# EAGLE design cryptostick-0v3 (EAGLE 6.6.0)

## Sheet 1 of 3: FTDI USB-Conn., FTDI-Chip
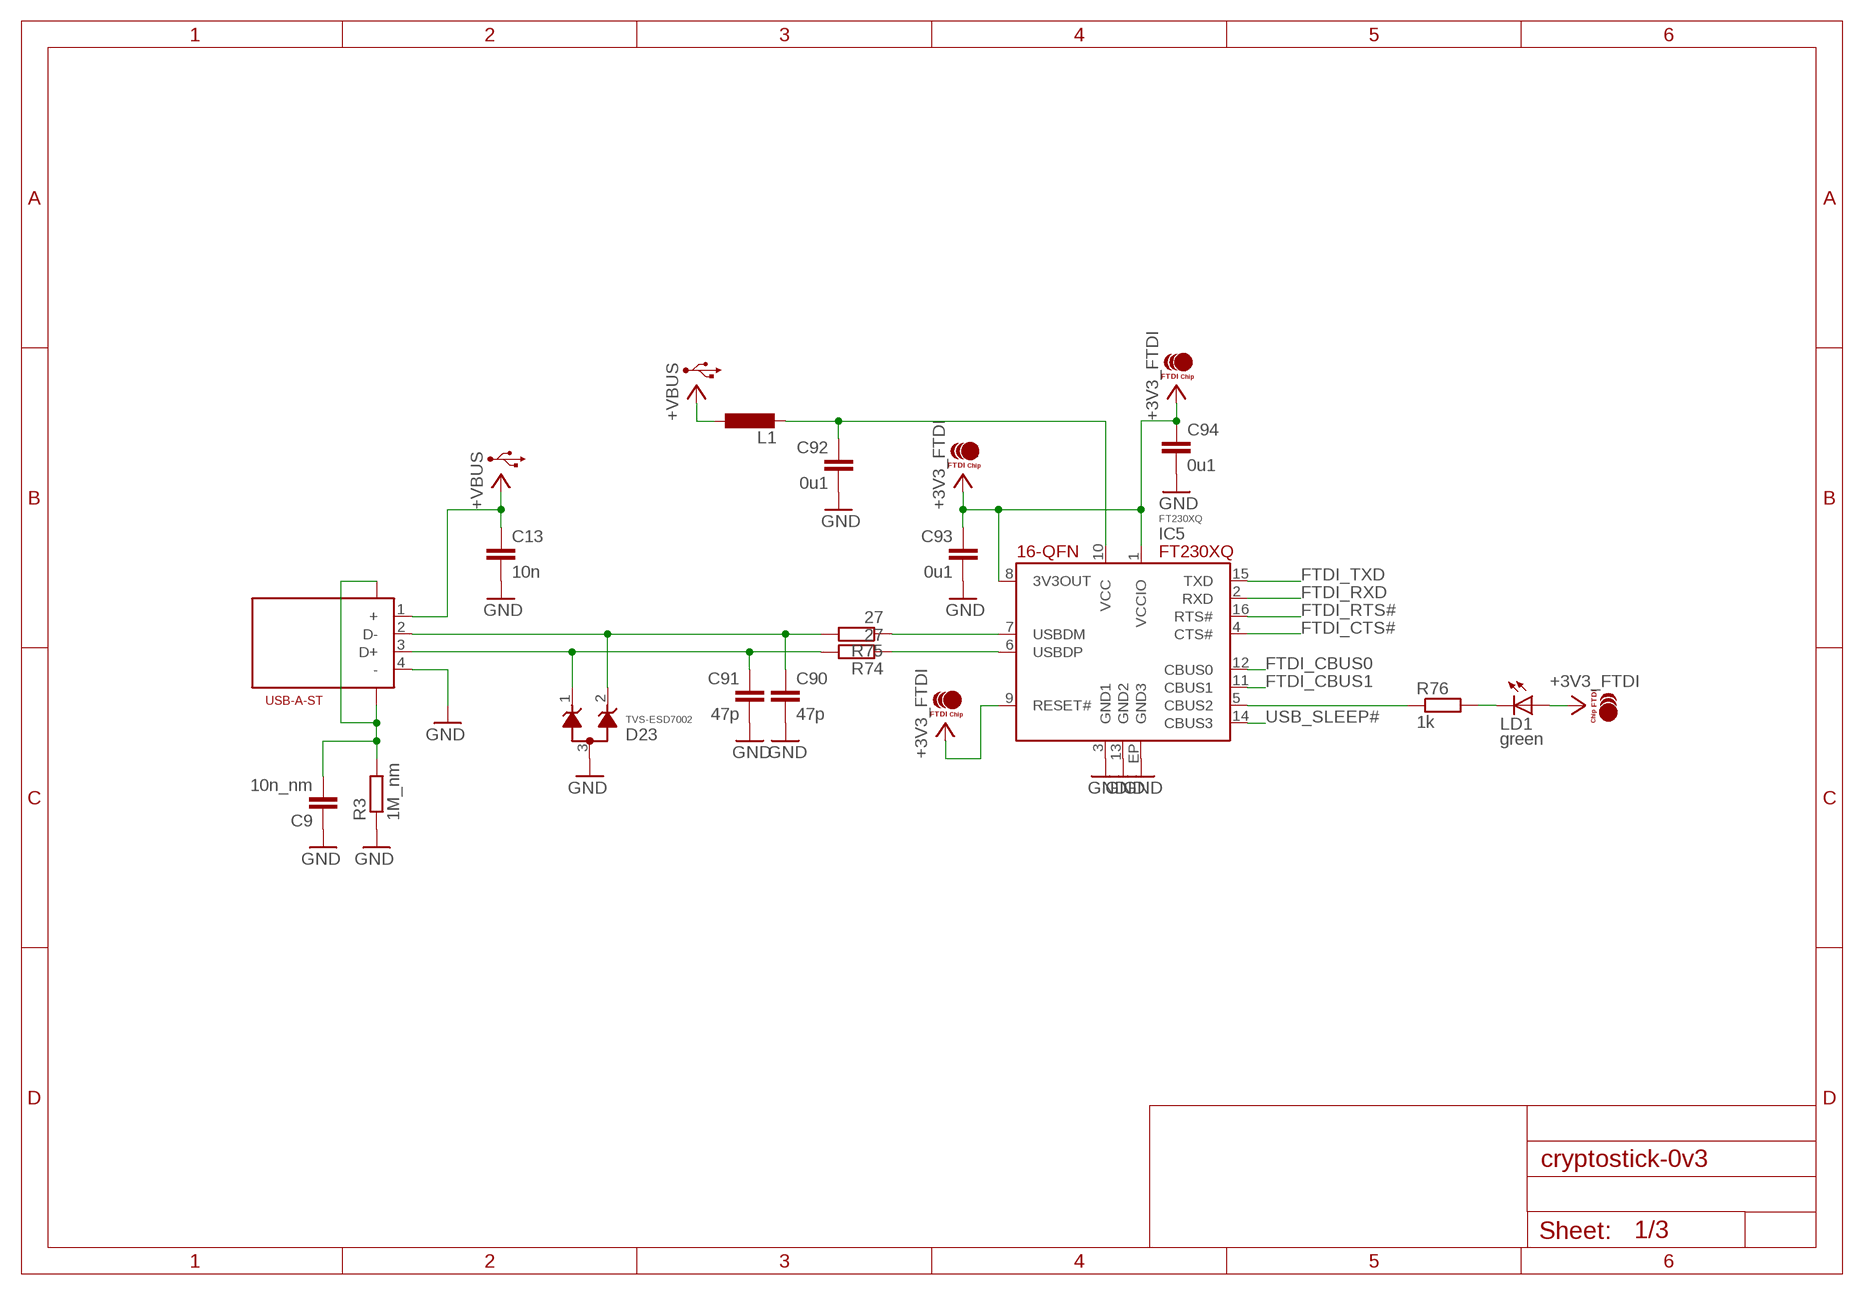
[diagram p0: schematic, sheet 1]

### Parts
C9  10n_nm  C-EUC0603  [C0603]
C13  10n  C-EUR0402-MCU  [R0402-MCU]
C90  47p  C-EUR0402-MCU  [R0402-MCU]
C91  47p  C-EUR0402-MCU  [R0402-MCU]
C92  0u1  C-EUR0402-MCU  [R0402-MCU]
C93  0u1  C-EUR0402-MCU  [R0402-MCU]
C94  0u1  C-EUR0402-MCU  [R0402-MCU]
D23  TVS-ESD7002  [SC70-3]
IC5  FT230XQ  [16QFN-FT230X]
J1  USB-A-ST  [USB-A-ST]
L1  L-EUR0402-MCU  [R0402-MCU]
LD1  green  LED-0603-SIDELED-RPI  [0603-SIDELED-RPI]
R3  1M_nm  R-EU_R0603  [R0603]
R74  27  R-EU_R0402-MCU  [R0402-MCU]
R75  27  R-EU_R0402-MCU  [R0402-MCU]
R76  1k  R-EU_R0402-MCU  [R0402-MCU]

### Nets
+3V3_FTDI: C93.1 C94.1 IC5.1(VCCIO) IC5.8(3V3OUT) IC5.9(RESET#) LD1.A ; also sheet 2,3
+5V_FTDI: C92.1 IC5.10(VCC) L1.2
+VBUS: C13.1 J1.1(+) L1.1 ; also sheet 2,3
FTDI_CBUS0: IC5.12(CBUS0) ; also sheet 2
FTDI_CBUS1: IC5.11(CBUS1) ; also sheet 2
FTDI_CTS#: IC5.4(CTS#) ; also sheet 2
FTDI_RTS#: IC5.16(RTS#) ; also sheet 2
FTDI_RXD: IC5.2(RXD) ; also sheet 2
FTDI_TXD: IC5.15(TXD) ; also sheet 2
FTDI_TXLED#: IC5.5(CBUS2) R76.1
GND: C9.1 C13.2 C90.2 C91.2 C92.2 C93.2 C94.2 D23.3 IC5.3(GND1) IC5.13(GND2) IC5.EP(GND3) J1.4(-) R3.1 ; also sheet 2,3
N$10: LD1.C R76.2
N$39: IC5.7(USBDM) R75.1
N$40: IC5.6(USBDP) R74.1
N$75: C91.1 D23.1 J1.3(D+) R74.2
N$76: C90.1 D23.2 J1.2(D-) R75.2
USB_SHLD: C9.2 J1.SH1 J1.SH2 R3.2
USB_SLEEP#: IC5.14(CBUS3) ; also sheet 2

## Sheet 2 of 3: MCU MSP430 Microcontroller, Crypto-IC
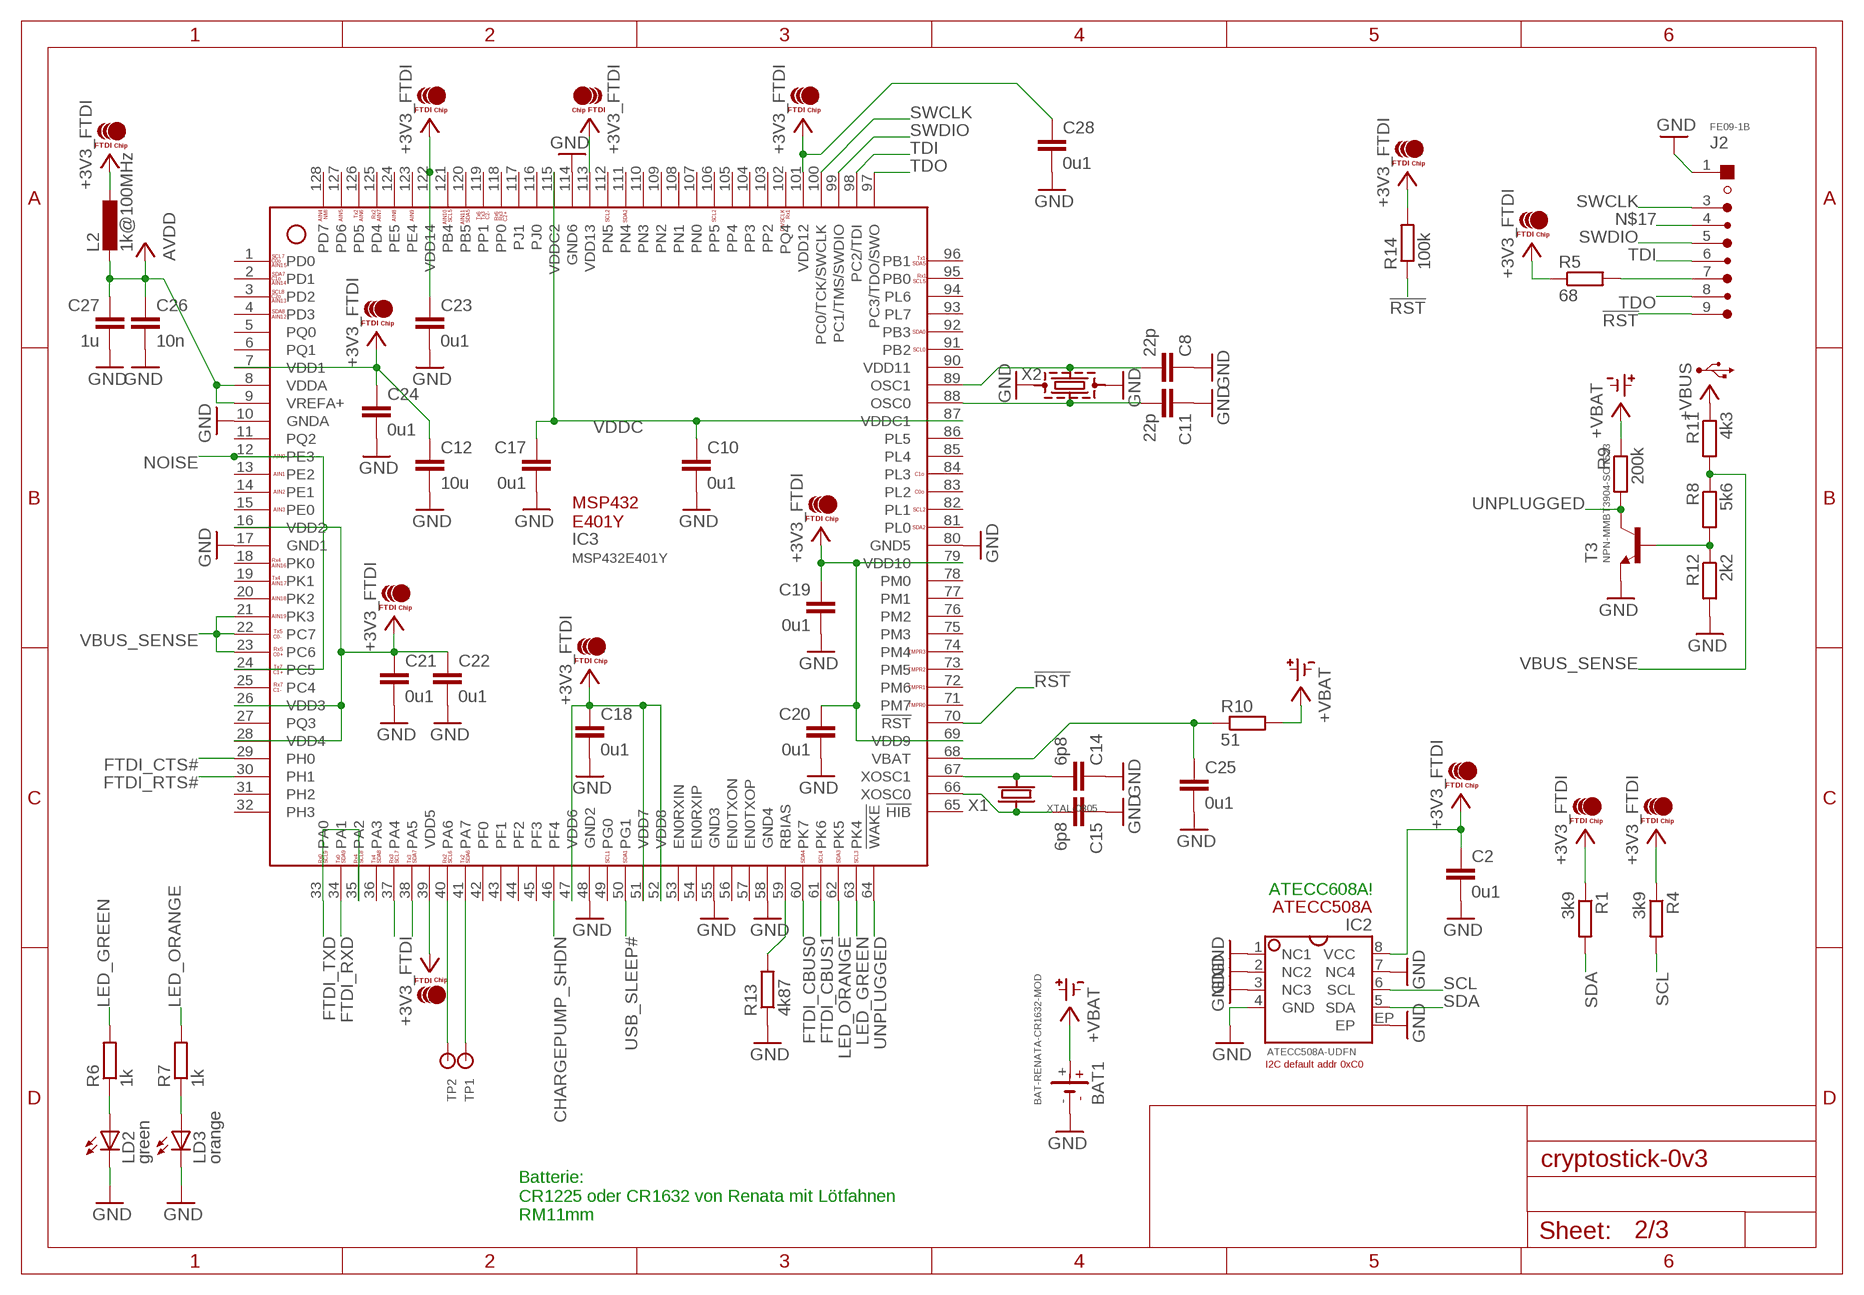
[diagram p1: schematic, sheet 2]

### Parts
BAT1  BAT-RENATA-CR1632-MOD  [BAT-RENATA-CR1632-MOD]
C2  0u1  C-EUR0402-MCU  [R0402-MCU]
C8  22p  C-EUR0402-MCU  [R0402-MCU]
C10  0u1  C-EUR0402-MCU  [R0402-MCU]
C11  22p  C-EUR0402-MCU  [R0402-MCU]
C12  10u  C-EUR0603-MCU  [R0603-MCU]
C14  6p8  C-EUR0402-MCU  [R0402-MCU]
C15  6p8  C-EUR0402-MCU  [R0402-MCU]
C17  0u1  C-EUR0402-MCU  [R0402-MCU]
C18  0u1  C-EUR0402-MCU  [R0402-MCU]
C19  0u1  C-EUR0402-MCU  [R0402-MCU]
C20  0u1  C-EUR0402-MCU  [R0402-MCU]
C21  0u1  C-EUR0402-MCU  [R0402-MCU]
C22  0u1  C-EUR0402-MCU  [R0402-MCU]
C23  0u1  C-EUR0402-MCU  [R0402-MCU]
C24  0u1  C-EUR0402-MCU  [R0402-MCU]
C25  0u1  C-EUR0402-MCU  [R0402-MCU]
C26  10n  C-EUR0402-MCU  [R0402-MCU]
C27  1u  C-EUR0402-MCU  [R0402-MCU]
C28  0u1  C-EUR0402-MCU  [R0402-MCU]
IC2  ATECC508A-UDFN  [8UDFN]
IC3  MSP432E401Y  [128TQFP-MSP432E401Y]
J2  FE09-1B  [FE09-1B]
L2  1k@100MHz  L-EUR0402-MCU  [R0402-MCU]
LD2  green  LED-0603-SIDELED-RPI  [0603-SIDELED-RPI]
LD3  orange  LED-0603-SIDELED-RPI  [0603-SIDELED-RPI]
R1  3k9  R-EU_R0402-MCU  [R0402-MCU]
R4  3k9  R-EU_R0402-MCU  [R0402-MCU]
R5  68  R-EU_R0402-MCU  [R0402-MCU]
R6  1k  R-EU_R0402-MCU  [R0402-MCU]
R7  1k  R-EU_R0402-MCU  [R0402-MCU]
R8  5k6  R-EU_R0402-MCU  [R0402-MCU]
R9  200k  R-EU_R0402-MCU  [R0402-MCU]
R10  51  R-EU_R0402-MCU  [R0402-MCU]
R11  4k3  R-EU_R0402-MCU  [R0402-MCU]
R12  2k2  R-EU_R0402-MCU  [R0402-MCU]
R13  4k87  R-EU_R0402-MCU  [R0402-MCU]
R14  100k  R-EU_R0402-MCU  [R0402-MCU]
T3  NPN-MMBT3904-SOT523  [SOT523]
TP1  TP-SMT-1.5MM  [TP-SMT-1.5MM]
TP2  TP-SMT-1.5MM  [TP-SMT-1.5MM]
X1  XTAL-0805  [XTAL-32KHZ-0805]
X2  XTAL-2.0X1.6-MOD  [XTAL-2.0X1.6-MOD]

### Nets
!RST: IC3.70(!RST) J2.9 R14.1
+3V3_FTDI: C2.1 C12.1 C18.1 C19.1 C20.1 C21.1 C22.1 C23.1 C24.1 C28.1 IC2.8(VCC) IC3.7(VDD1) IC3.16(VDD2) IC3.26(VDD3) IC3.28(VDD4) IC3.39(VDD5) IC3.47(VDD6) IC3.51(VDD7) IC3.52(VDD8) IC3.69(VDD9) IC3.79(VDD10) IC3.101(VDD12) IC3.113(VDD13) IC3.122(VDD14) L2.1 R1.1 R4.1 R5.1 R14.2 ; also sheet 1,3
+VBAT: BAT1.+ R9.1 R10.2
+VBUS: R11.1 ; also sheet 1,3
AVDD: C26.1 C27.1 IC3.8(VDDA) IC3.9(VREFA+) L2.2
CHARGEPUMP_SHDN: IC3.46(PF4) ; also sheet 3
DBG_RXD: IC3.40(PA6) IC3.74(PM4) TP2.1
DBG_TXD: IC3.41(PA7) IC3.73(PM5) TP1.1
FTDI_CBUS0: IC3.60(PK7) ; also sheet 1
FTDI_CBUS1: IC3.61(PK6) ; also sheet 1
FTDI_CTS#: IC3.29(PH0) ; also sheet 1
FTDI_RTS#: IC3.30(PH1) ; also sheet 1
FTDI_RXD: IC3.34(PA1) ; also sheet 1
FTDI_TXD: IC3.33(PA0) IC3.35(PA2) ; also sheet 1
GND: BAT1.- C2.2 C8.1 C10.2 C11.1 C12.2 C14.1 C15.1 C17.2 C18.2 C19.2 C20.2 C21.2 C22.2 C23.2 C24.2 C25.2 C26.2 C27.2 C28.2 IC2.1(NC1) IC2.2(NC2) IC2.3(NC3) IC2.4(GND) IC2.7(NC4) IC2.EP IC3.10(GNDA) IC3.17(GND1) IC3.48(GND2) IC3.55(GND3) IC3.58(GND4) IC3.80(GND5) IC3.114(GND6) J2.1 LD2.C LD3.C R12.2 R13.1 T3.2(E) X2.2(GND1) X2.4(GND2) ; also sheet 1,3
LED_GREEN: IC3.63(PK4) R6.2
LED_ORANGE: IC3.62(PK5) R7.2
N$1: J2.7 R5.2
N$3: LD3.A R7.1
N$4: LD2.A R6.1
N$11: C11.2 IC3.88(OSC0) X2.1
N$13: C8.2 IC3.89(OSC1) X2.3
N$14: C25.1 IC3.68(VBAT) R10.1
N$16: C14.2 IC3.67(XOSC1) X1.P$1
N$17: J2.4
N$18: R8.2 R12.1 T3.1(B)
N$19: C15.2 IC3.66(XOSC0) X1.P$2
N$21: IC3.59(RBIAS) R13.2
NOISE: IC3.12(PE3) IC3.24(PC5) ; also sheet 3
SCL: IC2.6(SCL) IC3.37(PA4) R4.2
SDA: IC2.5(SDA) IC3.38(PA5) R1.2
SWCLK: IC3.100(PC0/TCK/SWCLK) J2.3
SWDIO: IC3.99(PC1/TMS/SWDIO) J2.5
TDI: IC3.98(PC2/TDI) J2.6
TDO: IC3.97(PC3/TDO/SWO) J2.8
UNPLUGGED: IC3.64(!WAKE) IC3.72(PM6) R9.2 T3.3(C)
USB_SLEEP#: IC3.50(PG1) ; also sheet 1
VBUS_SENSE: IC3.21(PK3) IC3.22(PC7) IC3.23(PC6) R8.1 R11.2
VDDC: C10.1 C17.1 IC3.87(VDDC1) IC3.115(VDDC2)
Unconnected: IC3.1(PD0) IC3.2(PD1) IC3.3(PD2) IC3.4(PD3) IC3.5(PQ0) IC3.6(PQ1) IC3.11(PQ2) IC3.13(PE2) IC3.14(PE1) IC3.15(PE0) IC3.18(PK0) IC3.19(PK1) IC3.20(PK2) IC3.25(PC4) IC3.27(PQ3) IC3.31(PH2) IC3.32(PH3) IC3.36(PA3) IC3.42(PF0) IC3.43(PF1) IC3.44(PF2) IC3.45(PF3) IC3.49(PG0) IC3.53(EN0RXIN) IC3.54(EN0RXIP) IC3.56(EN0TXON) IC3.57(EN0TXOP) IC3.65(!HIB) IC3.71(PM7) IC3.75(PM3) IC3.76(PM2) IC3.77(PM1) IC3.78(PM0) IC3.81(PL0) IC3.82(PL1) IC3.83(PL2) IC3.84(PL3) IC3.85(PL4) IC3.86(PL5) IC3.90(VDD11) IC3.91(PB2) IC3.92(PB3) IC3.93(PL7) IC3.94(PL6) IC3.95(PB0) IC3.96(PB1) IC3.102(PQ4) IC3.103(PP2) IC3.104(PP3) IC3.105(PP4) IC3.106(PP5) IC3.107(PN0) IC3.108(PN1) IC3.109(PN2) IC3.110(PN3) IC3.111(PN4) IC3.112(PN5) IC3.116(PJ0) IC3.117(PJ1) IC3.118(PP0) IC3.119(PP1) IC3.120(PB5) IC3.121(PB4) IC3.123(PE4) IC3.124(PE5) IC3.125(PD4) IC3.126(PD5) IC3.127(PD6) IC3.128(PD7)

### Notes on the sheet
- ATECC608A!
- Batterie:
  CR1225 oder CR1632 von Renata mit Lötfahnen
  RM11mm

## Sheet 3 of 3: TRNG True Random Noise Generator: Noise Diode, Charge Pump
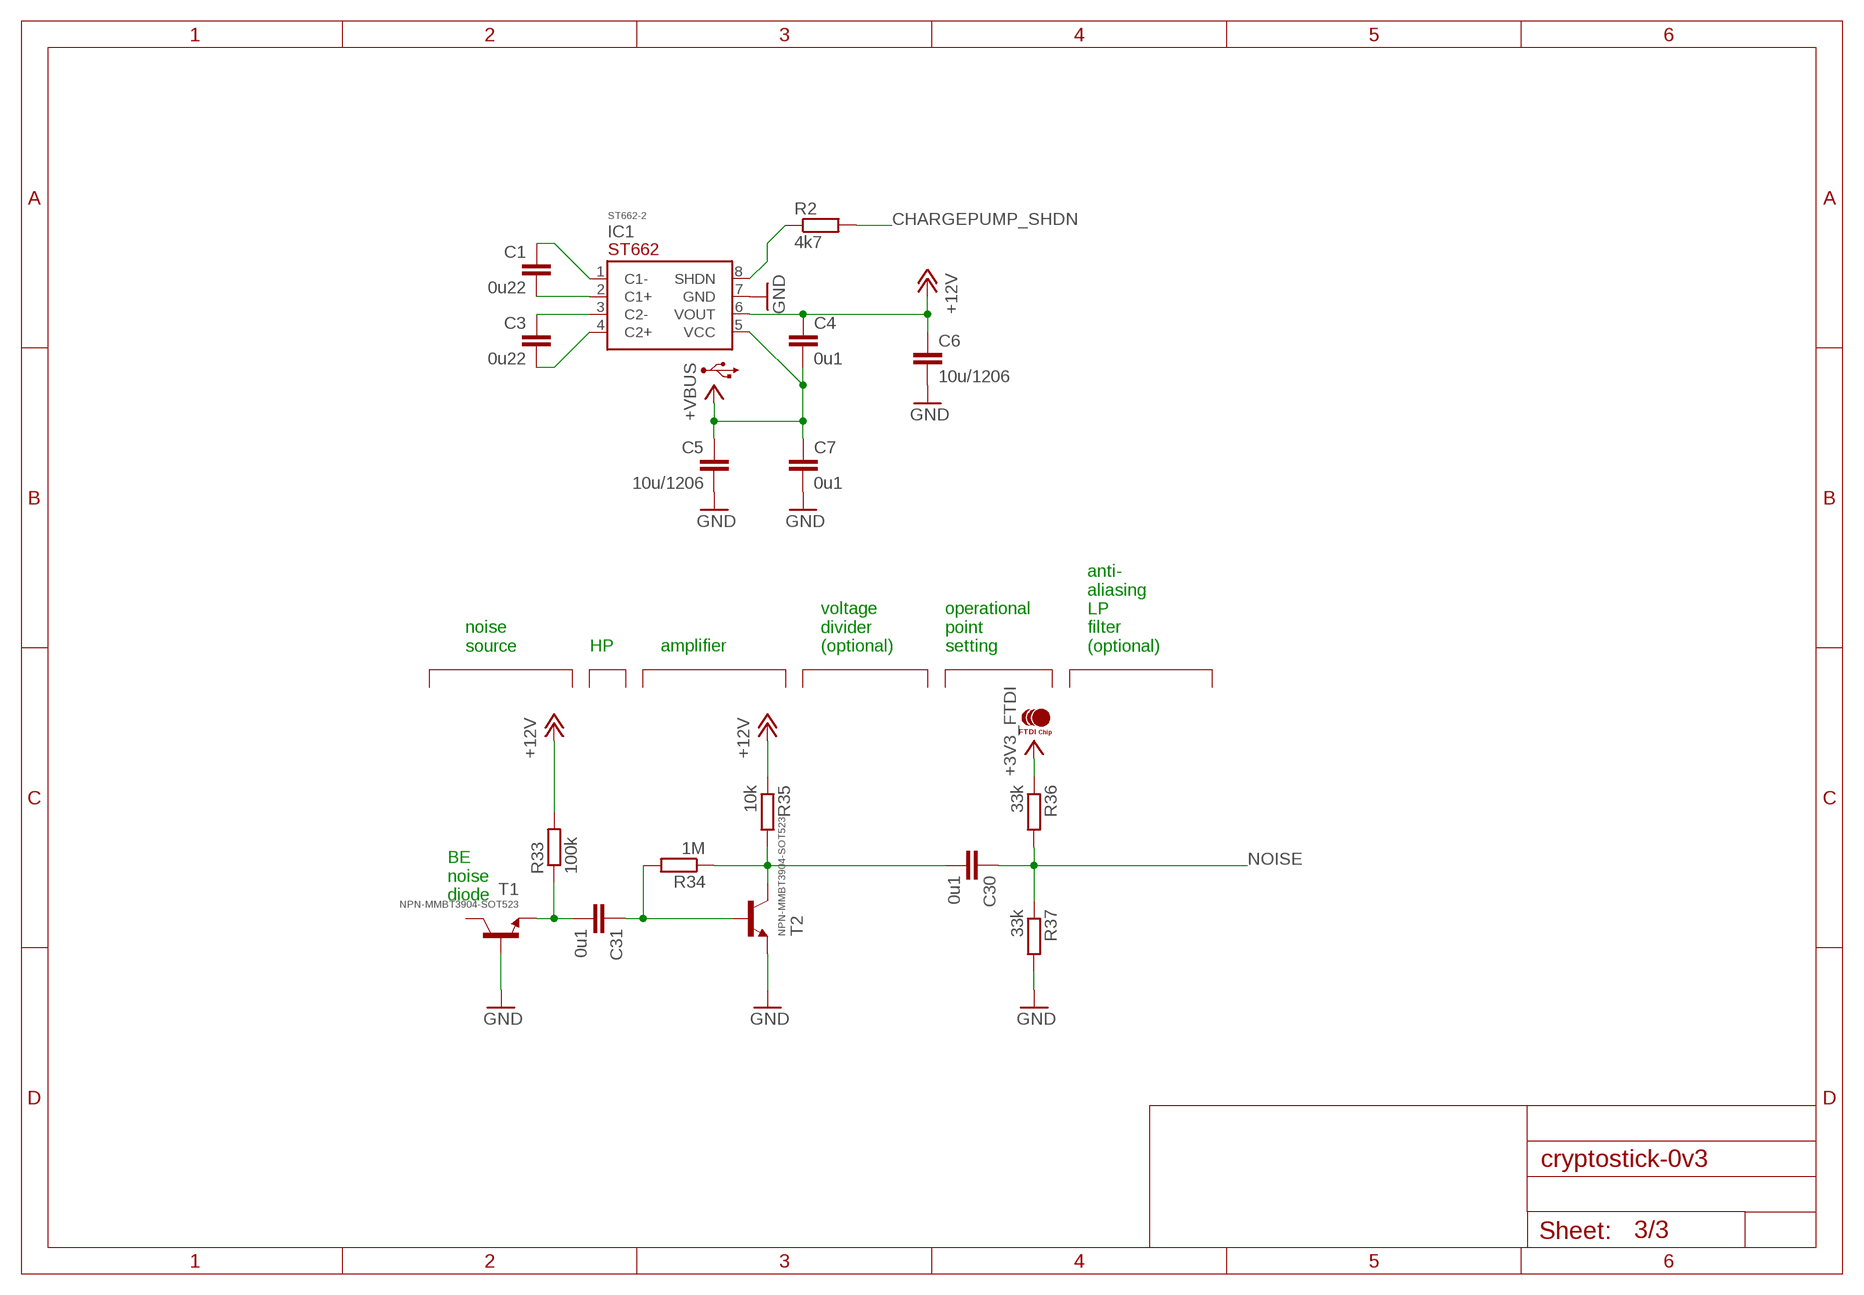
[diagram p2: schematic, sheet 3]

### Parts
C1  0u22  C-EUC0603  [C0603]
C3  0u22  C-EUC0603  [C0603]
C4  0u1  C-EUR0402-MCU  [R0402-MCU]
C5  10u/1206  C-EUC1206  [C1206]
C6  10u/1206  C-EUC1206  [C1206]
C7  0u1  C-EUR0402-MCU  [R0402-MCU]
C30  0u1  C-EUR0402-MCU  [R0402-MCU]
C31  0u1  C-EUR0402-MCU  [R0402-MCU]
IC1  ST662-2  [8SOIC-2]
R2  4k7  R-EU_R0402-MCU  [R0402-MCU]
R33  100k  R-EU_R0402-MCU  [R0402-MCU]
R34  1M  R-EU_R0402-MCU  [R0402-MCU]
R35  10k  R-EU_R0402-MCU  [R0402-MCU]
R36  33k  R-EU_R0402-MCU  [R0402-MCU]
R37  33k  R-EU_R0402-MCU  [R0402-MCU]
T1  NPN-MMBT3904-SOT523  [SOT523]
T2  NPN-MMBT3904-SOT523  [SOT523]

### Nets
+3V3_FTDI: R36.1 ; also sheet 1,2
+12V: C4.1 C6.1 IC1.6(VOUT) R33.2 R35.1
+VBUS: C4.2 C5.1 C7.1 IC1.5(VCC) ; also sheet 1,2
CHARGEPUMP_SHDN: R2.2 ; also sheet 2
GND: C5.2 C6.2 C7.2 IC1.7(GND) R37.2 T1.1(B) T2.2(E) ; also sheet 1,2
N$2: C31.1 R34.2 T2.1(B)
N$5: C30.2 R34.1 R35.2 T2.3(C)
N$6: C3.1 IC1.3(C2-)
N$7: C1.2 IC1.2(C1+)
N$8: C1.1 IC1.1(C1-)
N$9: C3.2 IC1.4(C2+)
N$12: IC1.8(SHDN) R2.1
N$35: C31.2 R33.1 T1.2(E)
NOISE: C30.1 R36.2 R37.1 ; also sheet 2
Unconnected: T1.3(C)

### Notes on the sheet
- noise
  source
- HP | amplifier
- voltage
  divider
  (optional)
- operational
  point
  setting
- anti-
  aliasing
  LP
  filter
  (optional)
- BE
  noise
  diode

## Library data of the parts
BAT1 = cryptostick:BAT
C1-C15 C17-C28 C30 C31 C90-C94 = rcl:C-EU: CAPACITOR, European symbol
D23 = hg-box:TVS-ESD7002
IC1 = cryptostick:ST662
IC2 = hg-box:ATECC508A-UDFN
IC3 = cryptostick:MSP432E401Y
IC5 = bdsm:FT230XQ
J1 = cocs:USB-A-ST
J2 = cryptostick:FE09-1B
L1 L2 = rcl:L-EU: INDUCTOR, European symbol
LD1-LD3 = led:LED: LED OSRAM: - CHIPLED LG R971, LG N971, LY N971, LG Q971, LY Q971, LO R971, LY R971 LH N974, LH R974 LS Q976, LO Q976, LY Q976 LO Q996 - Hyper CHIPLED LW Q18S LB Q993, LB Q99A, LB R99A - SideLED LS A670, LO A670, LY A670, LG A670, LP A670 LB A673, LV A673, LT A673, LW A673 LH A674 LY A675 LS A676, LA A676, LO A676, LY A676, LW A676 LS A679, LY A679, LG A679 - Hyper Micro SIDELED® LS Y876, LA Y876, LO Y876, LY Y876 LT Y87S - SmartLED LW L88C, LW L88S LB L89C, LB L89S, LG L890 LS L89K, LO L89K, LY L89K LS L896, LA L896, LO L896, LY L896 - TOPLED LS T670, LO T670, LY T670, LG T670, LP T670 LSG T670, LSP T670, LSY T670, LOP T670, LYG T670 LG T671, LOG T671, LSG T671 LB T673, LV T673, LT T673, LW T673 LH T674 LS T676, LA T676, LO T676, LY T676, LB T676, LH T676, LSB T676, LW T676 LB T67C, LV T67C, LT T67C, LS T67K, LO T67K, LY T67K, LW E67C LS E67B, LA E67B, LO E67B, LY E67B, LB E67C, LV E67C, LT E67C LW T67C LS T679, LY T679, LG T679 LS T770, LO T770, LY T770, LG T770, LP T770 LB T773, LV T773, LT T773, LW T773 LH T774 LS E675, LA E675, LY E675, LS T675 LS T776, LA T776, LO T776, LY T776, LB T776 LHGB T686 LT T68C, LB T68C - Hyper Mini TOPLED® LB M676 - Mini TOPLED Santana® LG M470 LS M47K, LO M47K, LY M47K Source: http://www.osram.convergy.de LUXEON: - LUMILED® LXK2-PW12-R00, LXK2-PW12-S00, LXK2-PW14-U00, LXK2-PW14-V00 LXK2-PM12-R00, LXK2-PM12-S00, LXK2-PM14-U00 LXK2-PE12-Q00, LXK2-PE12-R00, LXK2-PE12-S00, LXK2-PE14-T00, LXK2-PE14-U00 LXK2-PB12-K00, LXK2-PB12-L00, LXK2-PB12-M00, LXK2-PB14-N00, LXK2-PB14-P00, LXK2-PB14-Q00 LXK2-PR12-L00, LXK2-PR12-M00, LXK2-PR14-Q00, LXK2-PR14-R00 LXK2-PD12-Q00, LXK2-PD12-R00, LXK2-PD12-S00 LXK2-PH12-R00, LXK2-PH12-S00 LXK2-PL12-P00, LXK2-PL12-Q00, LXK2-PL12-R00 Source: www.luxeon.com KINGBRIGHT: KA-3528ASYC Source: www.kingbright.com
R1-R14 R33-R37 R74-R76 = rcl:R-EU_: RESISTOR, European symbol
T1-T3 = bdsm:NPN-MMBT3904
TP1 TP2 = hg-box:TP
X1 = cocs:XTAL-0805
X2 = cocs:XTAL

## Board
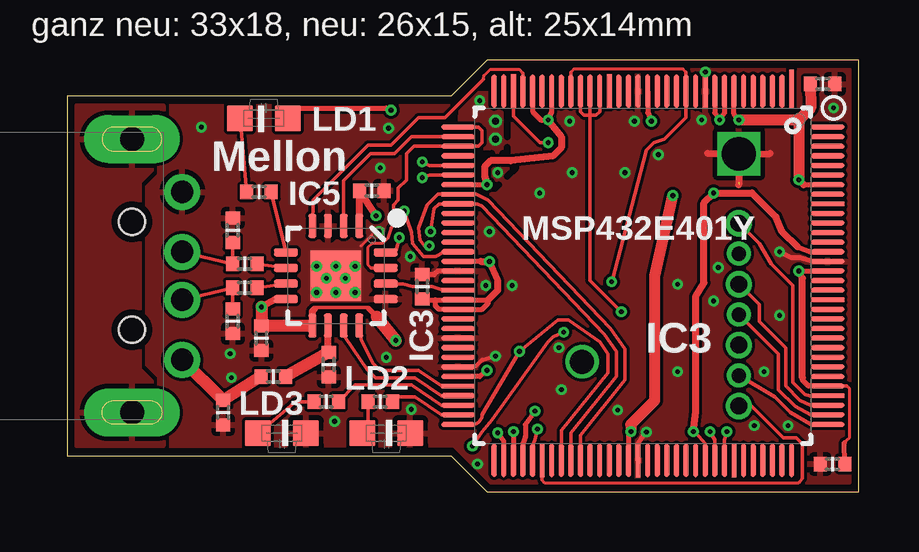
[diagram p3: board, top side]
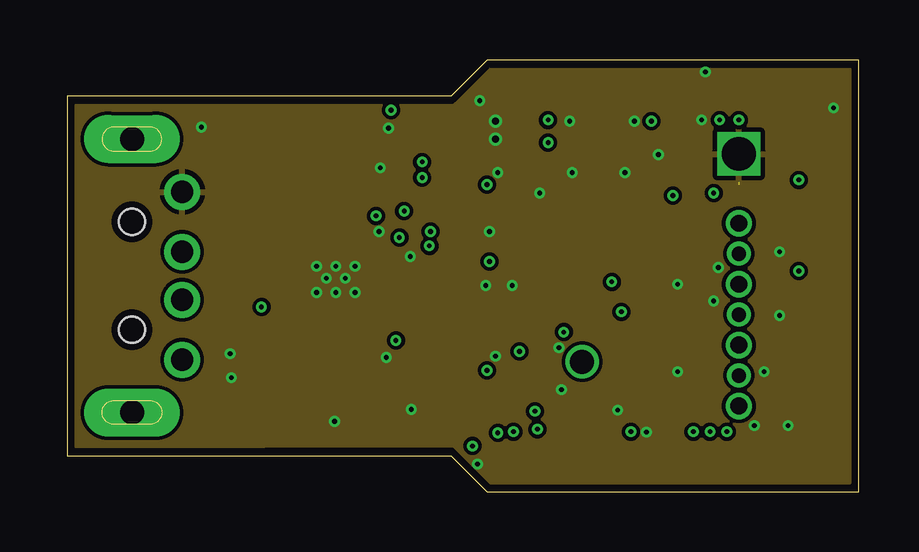
[diagram p4: board, inner layer Route2]
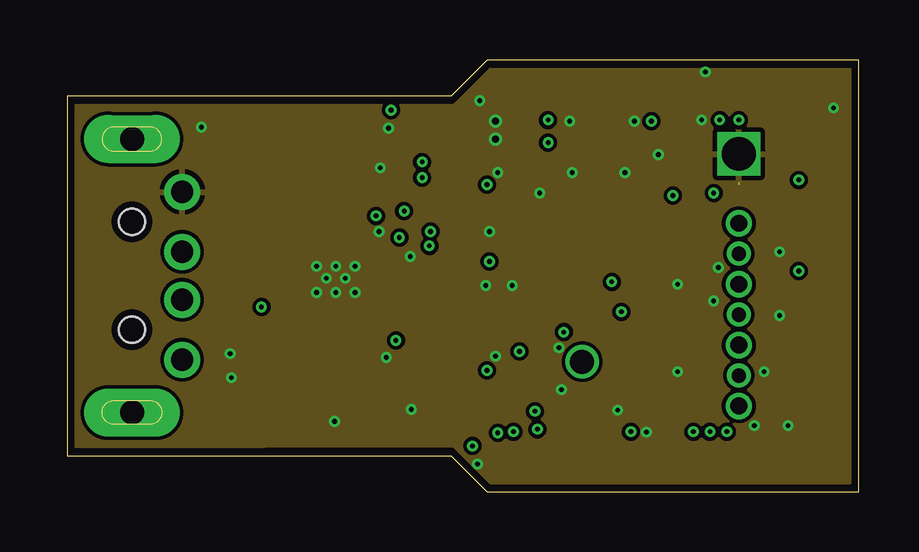
[diagram p5: board, inner layer Route15]
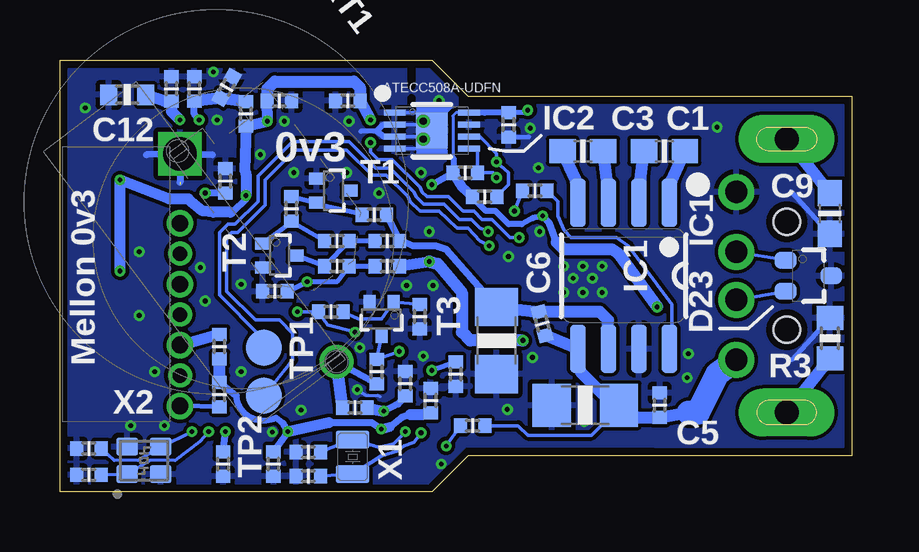
[diagram p6: board, bottom side, seen from below]

Size 33 x 18 mm. Coordinates in mm from the lower left corner, seen from the top.
Outline: 0,1.5 16,1.5 17.5,0 33,0 33,18 17.5,18 16,16.5 0,16.5 0,1.5
Copper layers (1+2*15+16): Top 0.035mm / dielectric 0.14mm / Route2 0.035mm / dielectric 1.2mm / Route15 0.035mm / dielectric 0.14mm / Bottom 0.035mm
Design rules "multicb_ML4": minimum track width 0.125mm, minimum drill 0.2mm, track to track 0.125mm, track to pad 0.125mm, pad to pad 0.125mm, via to via 0.125mm, smd to smd 0.125mm, copper to edge 0.3mm, drill to drill 0.2mm, minimum pad ring 0.2mm, minimum via ring 0.125mm, stop-mask expansion 0.075mm, vias tented up to drill 0mil, thermal gap 0.2mm
tRestrict: 8 lines
bRestrict: 3 lines

### Footprints (pad centres in the part's own frame; a part is rotated, then mirrored left to right if it is on the bottom)
BAT-RENATA-CR1632-MOD = drill 1 pad 1.4: + 10.85,0 | drill 1.4 pad 1.8: - 0,0
C0603 = smd 1.1 x 1: 1 -0.85,0; 2 0.85,0
R0402-MCU = smd 0.54 x 0.6: 1 -0.51,0; 2 0.51,0
C1206 = smd 1.6 x 1.8: 1 -1.4,0; 2 1.4,0
R0603-MCU = smd 0.7 x 0.85: 1 -0.775,0; 2 0.775,0
SC70-3 = smd 0.7 x 0.9: 1 -0.65,-0.95; 2 0.65,-0.95; 3 0,0.95
8SOIC-2 = smd 0.66 x 2: 1 -1.905,-3.05; 2 -0.635,-3.05; 3 0.635,-3.05; 4 1.905,-3.05; 5 1.905,3.05; 6 0.635,3.05; 7 -0.635,3.05; 8 -1.905,3.05
8UDFN = smd 0.9 x 0.25: 1 -1.55,0.75; 2 -1.55,0.25; 3 -1.55,-0.25; 4 -1.55,-0.75; 5 1.55,-0.75; 6 1.55,-0.25; 7 1.55,0.25; 8 1.55,0.75 | smd 1.3 x 1.5: EP 0,0
128TQFP-MSP432E401Y = smd 0.2 x 1.6: 1 -6.2,-7.8 | smd 0.2 x 1.4: 2 -5.8,-7.7; 3 -5.4,-7.7; 4 -5,-7.7; 5 -4.6,-7.7; 6 -4.2,-7.7; 7 -3.8,-7.7; 8 -3.4,-7.7; 9 -3,-7.7; 10 -2.6,-7.7; 11 -2.2,-7.7; 12 -1.8,-7.7; 13 -1.4,-7.7; 14 -1,-7.7; 15 -0.6,-7.7; 16 -0.2,-7.7; 17 0.2,-7.7; 18 0.6,-7.7; 19 1,-7.7; 20 1.4,-7.7; 21 1.8,-7.7; 22 2.2,-7.7; 23 2.6,-7.7; 24 3,-7.7; 25 3.4,-7.7; 26 3.8,-7.7; 27 4.2,-7.7; 28 4.6,-7.7; 29 5,-7.7; 30 5.4,-7.7; 31 5.8,-7.7; 32 6.2,-7.7; 65 6.2,7.7; 66 5.8,7.7; 67 5.4,7.7; 68 5,7.7; 69 4.6,7.7; 70 4.2,7.7; 71 3.8,7.7; 72 3.4,7.7; 73 3,7.7; 74 2.6,7.7; 75 2.2,7.7; 76 1.8,7.7; 77 1.4,7.7; 78 1,7.7; 79 0.6,7.7; 80 0.2,7.7; 81 -0.2,7.7; 82 -0.6,7.7; 83 -1,7.7; 84 -1.4,7.7; 85 -1.8,7.7; 86 -2.2,7.7; 87 -2.6,7.7; 88 -3,7.7; 89 -3.4,7.7; 90 -3.8,7.7; 91 -4.2,7.7; 92 -4.6,7.7; 93 -5,7.7; 94 -5.4,7.7; 95 -5.8,7.7; 96 -6.2,7.7 | smd 1.4 x 0.2: 33 7.7,-6.2; 34 7.7,-5.8; 35 7.7,-5.4; 36 7.7,-5; 37 7.7,-4.6; 38 7.7,-4.2; 39 7.7,-3.8; 40 7.7,-3.4; 41 7.7,-3; 42 7.7,-2.6; 43 7.7,-2.2; 44 7.7,-1.8; 45 7.7,-1.4; 46 7.7,-1; 47 7.7,-0.6; 48 7.7,-0.2; 49 7.7,0.2; 50 7.7,0.6; 51 7.7,1; 52 7.7,1.4; 53 7.7,1.8; 54 7.7,2.2; 55 7.7,2.6; 56 7.7,3; 57 7.7,3.4; 58 7.7,3.8; 59 7.7,4.2; 60 7.7,4.6; 61 7.7,5; 62 7.7,5.4; 63 7.7,5.8; 64 7.7,6.2; 97 -7.7,6.2; 98 -7.7,5.8; 99 -7.7,5.4; 100 -7.7,5; 101 -7.7,4.6; 102 -7.7,4.2; 103 -7.7,3.8; 104 -7.7,3.4; 105 -7.7,3; 106 -7.7,2.6; 107 -7.7,2.2; 108 -7.7,1.8; 109 -7.7,1.4; 110 -7.7,1; 111 -7.7,0.6; 112 -7.7,0.2; 113 -7.7,-0.2; 114 -7.7,-0.6; 115 -7.7,-1; 116 -7.7,-1.4; 117 -7.7,-1.8; 118 -7.7,-2.2; 119 -7.7,-2.6; 120 -7.7,-3; 121 -7.7,-3.4; 122 -7.7,-3.8; 123 -7.7,-4.2; 124 -7.7,-4.6; 125 -7.7,-5; 126 -7.7,-5.4; 127 -7.7,-5.8; 128 -7.7,-6.2
16QFN-FT230X = smd 1 x 0.325: 1 -2.08,0.975; 2 -2.08,0.325; 3 -2.08,-0.325; 4 -2.08,-0.975; 9 2.08,-0.975; 10 2.08,-0.325; 11 2.08,0.325; 12 2.08,0.975 | smd 0.325 x 1: 5 -0.975,-2.08; 6 -0.325,-2.08; 7 0.325,-2.08; 8 0.975,-2.08; 13 0.975,2.08; 14 0.325,2.08; 15 -0.325,2.08; 16 -0.975,2.08 | smd 2.1 x 2.1: EP 0,0
USB-A-ST = drill 0.92 pad 1.5: 1 3.5,4.8; 2 1,4.8; 3 -1,4.8; 4 -3.5,4.8 | drill 1 pad 2 long: SH1 5.7,2.7; SH2 -5.7,2.7 | hole 1.1: -2.25,2.7; 2.25,2.7
FE09-1B = drill 1.4 pad 1.8 square: 1 0,5.43 | drill 0.7 pad 1.1: 3 0,2.54; 5 0,0; 7 0,-2.54; 9 0,-5.08 | drill 0.6 pad 1: 4 0,1.27; 6 0,-1.27; 8 0,-3.81
0603-SIDELED-RPI = smd 1.1 x 1.1: A -1,0.235; C 1,0.235
R0603 = smd 1 x 1.1: 1 -0.85,0; 2 0.85,0
SOT523 = smd 0.5 x 0.61: 1 -0.5,-0.7; 2 0.5,-0.7; 3 0,0.7
TP-SMT-1.5MM = smd 1.5 x 1.5: 1 0,0
XTAL-32KHZ-0805 = smd 0.75 x 1.4: P$1 -0.725,0; P$2 0.725,0
XTAL-2.0X1.6-MOD = smd 0.9 x 0.75: 1 -0.7,-0.575; 2 0.7,-0.575; 3 0.7,0.575; 4 -0.7,0.575

### Placement (x,y rotation side)
BAT1  28,14.08 307 bottom
C1  7.8,14.2 180 bottom
C2  14.3,15.3 270 bottom
C3  11.2,14.2 180 bottom
C4  12.9,7 285 bottom
C5  11.1,3.6 180 bottom
C6  14.8,6.3 270 bottom
C7  8,3.6 90 bottom
C8  31.8,1.8 0 bottom
C9  0.9,11.6 90 bottom
C10  26.2,1.15 270 bottom
C11  31.8,0.7 0 bottom
C12  30.2,16.55 180 bottom
C13  6.5,3.3 270 top
C14  22.65,1.65 0 bottom
C15  22.65,0.65 0 bottom
C17  26.1,12.95 90 bottom
C18  14.8,8.55 90 top
C19  24.1,1.15 270 bottom
C20  17.55,3.8 90 bottom
C21  21,16.3 180 bottom
C22  23.85,16.3 0 bottom
C23  31.5,17 0 top
C24  28.35,16.8 90 bottom
C25  18.6,4.5 90 bottom
C26  27.4,16.8 90 bottom
C27  26.05,16.85 60 bottom
C28  31.9,1.15 180 top
C30  21.45,9.4 180 bottom
C31  23.35,11.8 90 bottom
C90  6.9,7.1 270 top
C91  6.9,10.9 90 top
C92  10.9,5.3 270 top
C93  8.1,6.4 270 top
C94  12.7,12.55 0 top
D23  1.8,9 270 bottom
IC1  9.5,9 180 bottom
IC2  17.5,15.05 0 bottom
IC3  24,9 180 top
IC5  11.2,9 270 top
J1  0,9 270 top
J2  28,8.65 0 top
L1  8.6,4.8 0 top
L2  25.25,15.75 90 bottom
LD1  8.2,15.8 180 top
LD2  13.3,2.2 0 top
LD3  8.95,2.2 0 top
R1  16.1,13.3 0 bottom
R2  13.2,12.55 180 bottom
R3  0.9,6.4 270 bottom
R4  15.3,12.3 0 bottom
R5  26.35,6.05 90 bottom
R6  13.05,3.75 0 top
R7  10.8,3.75 0 top
R8  21.7,7.5 0 bottom
R9  19.8,5 90 bottom
R10  20.7,3.5 180 bottom
R11  15.8,2.75 180 bottom
R12  18,7.3 270 bottom
R13  16.5,4.9 90 bottom
R14  26.35,4.05 90 bottom
R33  19.9,11.55 0 bottom
R34  21.45,10.45 180 bottom
R35  19.35,10.45 180 bottom
R36  19.35,9.4 180 bottom
R37  24.05,8.35 180 bottom
R74  7.4,9.5 180 top
R75  7.4,8.5 180 top
R76  8,12.5 180 top
T1  21.6,12.55 270 bottom
T2  23.85,9.85 270 bottom
T3  19.6,7.2 180 bottom
TP1  24.5,6 0 bottom
TP2  24.5,4 0 bottom
X1  20.8,1.45 270 bottom
X2  29.5,1.3 0 bottom

### Tracks (layer width: path | path; a pad name or v marks a point on that pad's centre or on a via)
!RST
  Top 0.125: 19.8,0.5 19.9,0.38 30.5,0.38 30.65,0.55
  Top 0.15: IC3.70 19.8,0.5 | 30.65,0.55 30.65,2 30.4,2.25 29.85,2.25 28.55,3.55 J2.9
  Bottom 0.2: R14.1 J2.9
+3V3_FTDI  (via drill 0.2 pad 0.45)
  Top 0.125: 32.4,2.05 32.62,2.25 32.62,4.3 32.5,4.4
  Top 0.15: 10.3,7.6 10.38,7.67 12.53,7.67 12.55,7.65 | 19.4,1.9 19.5,2.15 v19.6,2.6 | 32.5,4.4 IC3.101
  Top 0.2: LD1.A 9.5,16 13.3,16 v13.5,15.9 | 12.55,7.65 12.9,7.3 | 15.35,8 15.35,7.75 15.5,7.6 IC3.52 | 15.35,8 IC3.51 17.55,8 17.55,7.85 17.3,7.6 16.35,7.6 | C18.1 14.9,8 15.35,8 | 17.25,9.6 IC3.47 | v23.5,2.5 23.4,2.4 IC3.79 | IC3.69 19.4,1.9 | IC3.26 20.2,15.85 v20.05,15.5 19.75,15.5 19.4,15.85 IC3.28 | 30.7,12.8 IC3.122 | v28,15.5 27.8,15.75 IC3.7 | IC3.39 v17.5,12.8 | IC3.16 24.2,15.8 v24.35,15.45 | IC3.101 30.9,4.4 30.65,4.65 30.65,4.75 | v30.5,9.2 IC3.113 | C28.1 32.4,2.05
  Top 0.3: IC5.8 8.71,8.03 v8.1,7.7 | 10.1,6.9 IC5.9 10.22,7.53 10.3,7.6 | IC5.1 12.18,12.28 12.2,12.3 C94.1 v12.88,11.5 | v30.5,13 30.7,12.8 | 17.25,9.6 v17.6,9.6 17.95,8.8 17.95,8.4 17.55,8 | v17.5,12.8 17.4,13.15 17.4,13.55 17.65,13.8 18.5,13.8 20.25,14 20.6,14.35 20.6,14.8 v20.05,15.5 | 30.65,4.75 30.65,8.9 v30.5,9.2
  Top 0.45: C23.1 31,16 30.5,15.5 | 30.5,15.5 v30.5,13 | 30.5,15.5 v28,15.5 | v25.25,12.35 24.5,9 24.5,3.8 23.5,2.8 v23.5,2.5
  Top 0.5: v8.1,7.7 C93.1 10.1,6.9 | 12.9,7.3 v13.7,6.3
  Bottom 0.125: IC2.8 16.5,15.8 16.62,15.68 16.62,13.93 16.6,13.9
  Bottom 0.2: v13.5,15.9 13.6,15.8 C2.1
  Bottom 0.25: C2.1 15.3,15.8 IC2.8 | v12.88,11.5 13.3,11.4 13.75,11.15 14.3,11.15 14.85,11.7 15.25,11.7 15.75,12.2 R4.1 | 16.6,13.9 R1.1 | 23.7,2.85 24,3.08 arc112 25.65,4
  Bottom 0.275: C19.1 23.55,2.4 v23.5,2.5
  Bottom 0.3: 12.3,10.4 12.6,11.2 v12.88,11.5 | 18.4,3.2 18.75,3.1 19.25,2.7 | v17.5,12.8 R1.1 | v25.25,12.35 25.25,12.2 25.8,11.65 25.9,11.65 | v19.6,2.6 20,2.88 21.8,2.88 | v23.5,2.5 23.7,2.85 | 25.65,4 R14.2
  Bottom 0.4: R4.1 16.25,12.7 R1.1 | 19.25,2.7 v19.6,2.6
  Bottom 0.45: R36.1 v17.6,9.6 | C21.1 v20.05,15.5 | C24.1 28.35,15.85 v28,15.5 | C20.1 17.9,3.2 18.4,3.2 | C22.1 v24.35,15.45 L2.1 25.3,13.4 25.25,13.25 v25.25,12.35 | 25.9,11.65 26.6,11.65 27.05,11.7 27.65,12.2 28.45,12.2 v30.5,13 v30.5,9.2 | 21.8,2.88 v23.5,2.5
  Bottom 0.5: v8.1,7.7 9.7,9.9 10,10.1 12,10.1 12.3,10.4 | v13.7,6.3 15.9,6.3 16.25,6.65 16.25,8.3 17.25,9.5 v17.6,9.6 | C22.1 24.35,16.8 24.05,17.1 20.75,17.1 20.5,16.85 C21.1 | R14.2 R5.1 | C12.1 28.65,16.3 C24.1
+5V_FTDI
  Top 0.3: C92.1 10.88,6.1 IC5.10
  Top 0.5: L1.2 C92.1
+12V
  Bottom 0.3: C6.1 16.9,10.1 17.35,10.25 18.3,10.25 18.75,10.45 R35.1 R33.2
  Bottom 0.5: IC1.6 10.15,7.15 10.5,7.5 11.8,7.5 C4.1 C6.1
+VBAT
  Bottom 0.3: R9.1 BAT1.+
  Bottom 0.5: R10.2 BAT1.+
+VBUS
  Top 0.5: J1.1 C13.1 L1.1
  Bottom 0.15: R11.1 13.9,2.75 13.5,2.35 10.85,2.35 9.95,3.25 C5.1
  Bottom 0.5: C4.2 IC1.5 11.3,5 10.4,4.1 C5.1 9.5,3.1 C7.1 6.8,3.3
  Bottom 1: 6.8,3.3 6.4,3.3 5.6,4.9 J1.1
AVDD  (via drill 0.2 pad 0.45)
  Top 0.2: IC3.8 27.4,15.8 v27.2,15.5 27,15.8 IC3.9
  Bottom 0.3: v27.2,15.5 27.4,15.75 C26.1
  Bottom 0.5: L2.2 C27.1 C26.1
CHARGEPUMP_SHDN  (via drill 0.2 pad 0.45)
  Top 0.15: v14.05,11.7 14.35,10.8 14.4,10.35 14.85,9.8 15.35,9.8 15.7,10 IC3.46
  Bottom 0.15: R2.2 v14.05,11.7
DBG_RXD  (via drill 0.2 pad 0.45)
  Top 0.15: v15.1,10.25 14.9,10.25 14.7,10.5 14.65,11 15,11.95 15.45,12.4 IC3.40 17.05,12.4 17.55,12.15 22.65,6.8 23.25,5.95 23.25,4.65 21.4,2.35 IC3.74
  Bottom 0.15: v15.1,10.25 15.5,10.45 16,11 16.45,11 17.2,11.7 18,11.7 18.4,12.1 18.5,12.3 19.4,13.2 20,13.2 21.05,14.25 23.2,14.25 24.45,13 24.45,11.95 25.6,10.8 25.85,10.8 26.05,10.6 26.05,8.35 24.85,7.15 23.85,7.15 23.3,6.6 23.3,5.5 TP2.1
DBG_TXD  (via drill 0.2 pad 0.45)
  Top 0.15: v15.15,10.85 15.3,11.8 15.5,12 IC3.41 17.1,12 17.3,11.9 22.4,6.55 22.9,5.85 22.9,4.8 21,2.45 IC3.73
  Bottom 0.15: v15.15,10.85 15.5,11 15.85,11.35 16.35,11.35 17,12 17.85,12 18.15,12.3 18.25,12.5 19.25,13.5 19.85,13.5 20.95,14.6 23.3,14.6 24.75,13.15 24.75,12.1 25.7,11.15 26,11.15 26.35,10.8 26.35,8.2 24.65,6.5 TP1.1
FTDI_CBUS0
  Top 0.15: IC5.12 12.25,6.35 12.75,5.35 13.05,5.05 14.65,5.05 15.6,4.4 IC3.60
FTDI_CBUS1
  Top 0.15: IC5.11 11.6,6.4 12.5,5.1 12.85,4.75 14.5,4.75 15.6,4 IC3.61
FTDI_CTS#
  Top 0.125: 17.35,17.2 17.38,17.35 17.64,17.61 18.85,17.61 19,17.45
  Top 0.15: IC5.4 10.25,12.15 12.55,14.45 13.5,14.45 14.65,15.6 15.75,15.6 17.35,17.2 | 19,17.45 IC3.29
FTDI_RTS#  (via drill 0.2 pad 0.45)
  Top 0.15: IC5.16 13.55,10.05 13.7,10.05 v13.85,10.6 | v20.05,14.55 19.7,14.55 18.6,15.65 IC3.30
  Bottom 0.15: v13.85,10.6 14.25,10.6 15,11.35 15.4,11.35 15.75,11.7 16.2,11.7 16.8,12.3 17.7,12.3 17.9,12.5 18,12.7 19.15,13.85 19.75,13.85 20.05,14.15 v20.05,14.55
FTDI_RXD
  Top 0.15: IC5.2 11.53,12.97 12.65,14.1 13.65,14.1 14.35,14.8 IC3.34
FTDI_TXD
  Top 0.125: 13.6,11.15 13.5,11 13.35,10.55 13.15,10.35 12.7,10.35 12.53,10.18 12.53,9.47 12.68,9.32
  Top 0.15: 13.6,11.15 13.6,11.95 13.8,12.15 13.8,12.65 14.15,13 14.15,14.1 14.45,14.4 IC3.35 17.15,14.4 17.3,14.55 17.3,15.05 17.15,15.2 IC3.33 | 12.68,9.32 IC5.15
FTDI_TXLED#
  Top 0.15: R76.1 IC5.5
GND  (via drill 0.2 pad 0.4, 0.2 pad 0.45, 0.3 pad 0.55)  (2 unrouted)
  Top 0.125: 12.25,10.25 12.7,10.7
  Top 0.175: 16.9,5.2 17.05,5.25 17.3,5.5 v17.85,5.65
  Top 0.2: IC3.80 23.8,2 23.95,2.25 v24.15,2.48 | IC3.114 31.1,9.6 30.55,9.75 30.2,9.75 v29.7,10 | IC3.48 15.45,9.2 15.3,9.05 C18.2 | IC3.58 16.9,5.2
  Top 0.3: BAT1.- 26.7,14.1 | BAT1.- 29.3,14.1 | BAT1.- 28,12.8
  Bottom 0.125: v20.6,4.25 20.25,4.01 19.75,4.01 19.65,3.95
  Bottom 0.15: 18,14.25 v17.85,14.7 | 18,15.85 v17.85,15.45 | 18.85,15.3 17.93,15.3 | 18.85,14.8 17.93,14.8 | 18.85,14.3 17.93,14.3 | 18.85,15.8 17.93,15.8
  Bottom 0.2: R3.1 2.5,5.5 | C9.1 2.5,12.5 | C2.2 13.45,14.8 | 19.8,15.03 20.45,15.03
  Bottom 0.25: 19.1,15.3 19.52,15.3 19.8,15.03 19.5,14.8 19.07,14.8
  Bottom 0.3: BAT1.- 26.65,14.05 | BAT1.- 29.4,14.05 | BAT1.- 28,12.9 | 17,15.85 18,15.85 18,16.1 16.75,16.1 17,15.85 | 17,14.25 17,14.05 18,14.05 18,14.25 17,14.25
  other vias: 31.95,16 5.6,15.2 17.2,16.3 13.05,13.5 11.2,8.3 13,10.85 13.4,15.15 28.65,2.75 26.95,7.95 6.85,4.75 18.55,8.6 14.3,9.8 17.1,1.15 11.15,2.92 27.15,9.35 6.8,5.75 29.7,7.35 10.4,9.4 10.4,8.3 12,8.3 12,9.4 25.45,8.65 11.2,9.4 10.8,8.9 11.6,8.9 14.35,3.42 23.65,15.45 26.6,17.5 26.45,15.5 20.95,15.45 17.95,13.3 24.65,14.05 29.05,5 22.95,3.4 25.45,5 20.5,6 17.45,8.6 13.3,5.6 19.7,12.45 23.25,13.3 21.05,13.3 17.6,10.85 30.05,2.75
  pour Top (isolate 0.125, rank 2): 32.62,17.62 32.62,0.38 17.65,0.38 16.1,1.9 0.38,1.88 0.38,16.12 16.1,16.1 17.6,17.6
  pour Bottom (isolate 0.15): 32.62,17.62 32.62,0.38 17.65,0.38 16.1,1.9 0.38,1.88 0.38,16.12 16.1,16.1 17.6,17.6
  pour Route2 (isolate 0.15): 32.62,17.62 32.62,0.38 17.65,0.38 16.1,1.9 0.38,1.88 0.38,16.12 16.1,16.1 17.6,17.6
  pour Route15 (isolate 0.15): 32.62,17.62 32.62,0.38 17.65,0.38 16.1,1.9 0.38,1.88 0.38,16.12 16.1,16.1 17.6,17.6
LED_GREEN
  Top 0.15: R6.2 13.75,3.95 14.5,3.95 15.6,3.2 IC3.63
LED_ORANGE
  Top 0.15: R7.2 12,4.45 14.35,4.45 15.6,3.6 IC3.62
N$1
  Bottom 0.45: R5.2 27.95,6.1 J2.7
N$2
  Bottom 0.2: R34.2 23.35,11.25 | 23.35,11.25 24.4,10.45 T2.1 | C31.1 23.35,11.25
N$3
  Top 0.15: LD3.A 9,3.3 9.5,3.75 R7.1
N$4
  Top 0.15: LD2.A 12.55,2.7 R6.1
N$5
  Bottom 0.2: R35.2 R34.1 C30.2 T2.3
N$6
  Bottom 0.5: IC1.3 10.2,13 C3.1
N$7
  Bottom 0.5: IC1.2 8.8,13 C1.2
N$8
  Bottom 0.5: IC1.1 7.5,13 C1.1
N$9
  Bottom 0.5: IC1.4 11.5,13 C3.2
N$10
  Top 0.15: LD1.C R76.2
N$11  (via drill 0.2 pad 0.45)
  Top 0.15: v26.8,2.5 27,2.15 IC3.88
  Bottom 0.125: 28.2,1.3 29.25,1.3 X2.1
  Bottom 0.15: v26.8,2.5 27.15,2.1 28.2,1.3 | C11.2 X2.1
N$12
  Bottom 0.15: IC1.8 7.5,6.6 7.5,7.8 9.3,10.25 9.8,10.6 11.7,10.6 12,10.9 12.25,11.5 12.25,12.1 R2.1
N$13  (via drill 0.2 pad 0.45)
  Top 0.15: IC3.89 27.4,2.15 v27.5,2.5
  Bottom 0.125: X2.3 29.75,1.3 30.75,1.3
  Bottom 0.15: X2.3 v27.5,2.5 | 30.75,1.3 C8.2
N$14  (via drill 0.2 pad 0.45)
  Top 0.2: v19.5,3.35 19.1,2.8 19.1,2.3 19,2 IC3.68
  Bottom 0.3: C25.1 18.9,3.65 v19.5,3.35
  Bottom 0.45: R10.1 v19.5,3.35
N$16  (via drill 0.2 pad 0.45)
  Top 0.2: v18.6,2.5 IC3.67
  Bottom 0.15: C14.2 X1.P$1 19.7,1.85 19.1,2 v18.6,2.5
N$18
  Bottom 0.15: R12.1 T3.1 19.6,7.2 20.55,7.2 R8.2
N$19  (via drill 0.2 pad 0.45)
  Top 0.2: IC3.66 18.2,2.1 v17.95,2.45
  Bottom 0.15: C15.2 X1.P$2 19.6,1.5 18.9,1.7 18.65,1.9 18.25,2.05 v17.95,2.45
N$21  (via drill 0.2 pad 0.45)
  Top 0.2: v17.5,5.05 17.2,4.8 IC3.59
  Bottom 0.2: R13.2 v17.5,5.05
N$35
  Bottom 0.2: C31.2 T1.2 22,11.9 20.55,11.6 R33.1
N$39
  Top 0.15: R75.1 IC5.7
N$40
  Top 0.15: IC5.6 R74.1
N$75
  Top 0.15: C91.1 R74.2 J1.3
  Bottom 0.15: D23.1 J1.3
N$76
  Top 0.15: C90.1 R75.2 J1.2
  Bottom 0.15: D23.2 J1.2
NOISE  (via drill 0.2 pad 0.45)
  Top 0.125: 25.8,17.5 25.68,17.62 21.12,17.62 21,17.5
  Top 0.15: v22.7,8.75 24.15,14.25 24.45,14.55 24.9,14.7 25.8,15.6 IC3.12 25.8,17.5 | 21,17.5 IC3.24
  Bottom 0.2: R36.2 C30.1 21.45,8.75 v22.7,8.75 R37.1
SCL  (via drill 0.2 pad 0.45)
  Top 0.15: IC3.37 15.1,13.6 v14.8,13.75
  Bottom 0.15: IC2.6 15.5,14.8 14.8,14.1 v14.8,13.75 14.3,13.3 14.3,12.8 R4.2
SDA  (via drill 0.2 pad 0.45)
  Top 0.15: v14.8,13.1 15.1,13.2 IC3.38
  Bottom 0.15: IC2.5 15.6,14.3 15.6,13.55 R1.2 14.95,13.3 v14.8,13.1
SWCLK
  Top 0.15: J2.3 28.85,10.35 29.35,9.5 30.25,8.6 30.25,4.55 30.75,4.05 30.95,4 IC3.100
SWDIO
  Top 0.15: IC3.99 31,3.6 30.55,3.8 29.95,4.4 29.95,6 28.85,7.1 28.85,7.8 J2.5
TDI
  Top 0.15: J2.6 29.65,5.75 29.65,4.25 30.35,3.55 31,3.2 IC3.98
TDO
  Top 0.15: IC3.97 31,2.8 30.15,3.3 29.5,3.95 J2.8
UNPLUGGED  (via drill 0.2 pad 0.45)
  Top 0.15: IC3.64 16.9,2.8 arc90 17.3,3.2 v18.85,5.85 20.45,7.15 20.9,7.15 22.2,6.25 22.55,5.75 22.55,4.95 20.6,2.55 IC3.72
  Bottom 0.15: T3.3 R9.2 v18.85,5.85
USB_SHLD
  Bottom 0.5: C9.2 J1.SH2 | R3.2 J1.SH1
  pour Top (isolate 0.2): 0.4,16.1 4,16.1 4,13.9 3,12.9 3,5.1 4,4.1 4,1.9 0.4,1.9
USB_SLEEP#
  Top 0.15: IC5.14 13.5,8.65 14,8.65 14.4,8.55 15.2,8.55 15.65,8.4 IC3.50
VBUS_SENSE  (via drill 0.2 pad 0.45)
  Top 0.15: v23.1,7.5 21.8,8.8 21.8,15.7 | IC3.21 22.2,15.85 22.05,15.7 21.8,15.7 | 21.8,15.7 IC3.22 | IC3.23 21.4,15.85 21.55,15.7 21.8,15.7 | v16.9,1.9 17.3,2.5 17.7,3 20.05,6.25 20.25,6.45 v20.7,6.65
  Bottom 0.15: R11.2 v16.9,1.9 | v23.1,7.5 R8.1 21.85,6.95 v20.7,6.65
VDDC  (via drill 0.2 pad 0.45)
  Top 0.15: 26.2,2.45 26.6,2 IC3.87
  Top 0.2: v26.1,2.5 26.2,2.45 | 30.45,10.2 31,10 IC3.115
  Top 0.3: 30.45,10.2 29.8,10.85 29.55,11.45 28.55,12.45 v26.95,12.45 26.55,12.05 26.55,8.7 26.2,8.15 26.2,3.35 v26.1,2.5
  Bottom 0.3: C10.1 v26.1,2.5 | C17.1 v26.95,12.45

### Text on the board
tPlace: https://www.digikey.de/short/j279b2 | ganz neu: 33x18, neu: 26x15, alt: 25x14mm | Mellon
bPlace: 0v3 | Mellon 0v3